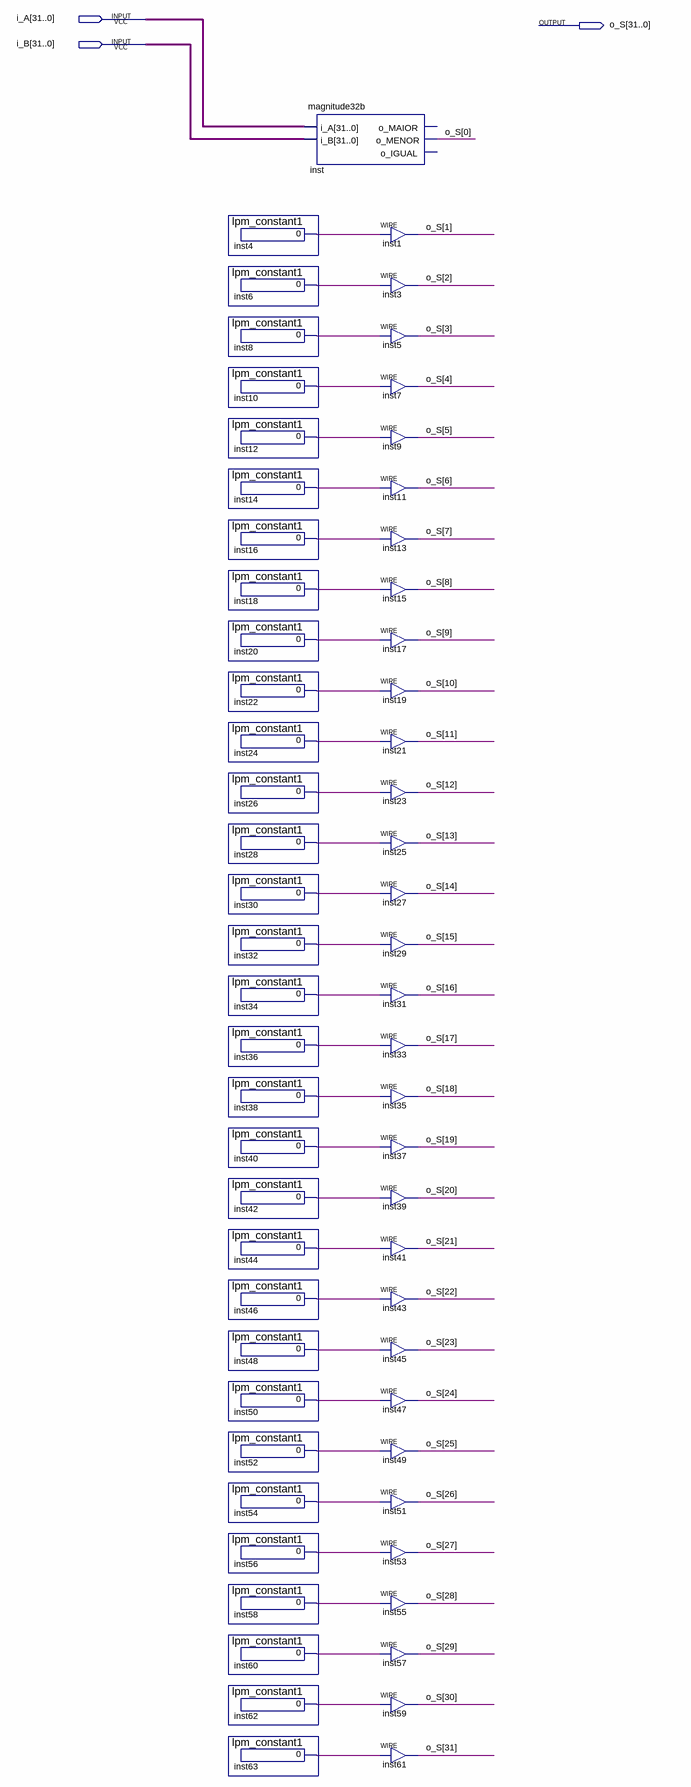
[diagram p0: schematic sheet]
// Quartus schematic set_on_less_than.bdf as structural Verilog: 63 symbols, 3 pins
module set_on_less_than (
  input  [31:0] i_A,
  input  [31:0] i_B,
  output [31:0] o_S
);

  wire inst4_result, inst6_result, inst8_result, inst10_result, inst12_result, inst14_result, inst16_result,
       inst18_result, inst20_result, inst22_result, inst24_result, inst26_result, inst28_result,
       inst30_result, inst32_result, inst34_result, inst36_result, inst38_result, inst40_result,
       inst42_result, inst44_result, inst46_result, inst48_result, inst50_result, inst52_result,
       inst54_result, inst56_result, inst58_result, inst60_result, inst62_result, inst63_result;

  lpm_constant1 inst4 (.result(inst4_result));
  lpm_constant1 inst6 (.result(inst6_result));
  lpm_constant1 inst8 (.result(inst8_result));
  lpm_constant1 inst10 (.result(inst10_result));
  lpm_constant1 inst12 (.result(inst12_result));
  lpm_constant1 inst14 (.result(inst14_result));
  lpm_constant1 inst16 (.result(inst16_result));
  lpm_constant1 inst18 (.result(inst18_result));
  lpm_constant1 inst20 (.result(inst20_result));
  lpm_constant1 inst22 (.result(inst22_result));
  lpm_constant1 inst24 (.result(inst24_result));
  lpm_constant1 inst26 (.result(inst26_result));
  lpm_constant1 inst28 (.result(inst28_result));
  lpm_constant1 inst30 (.result(inst30_result));
  lpm_constant1 inst32 (.result(inst32_result));
  lpm_constant1 inst34 (.result(inst34_result));
  lpm_constant1 inst36 (.result(inst36_result));
  lpm_constant1 inst38 (.result(inst38_result));
  lpm_constant1 inst40 (.result(inst40_result));
  lpm_constant1 inst42 (.result(inst42_result));
  lpm_constant1 inst44 (.result(inst44_result));
  lpm_constant1 inst46 (.result(inst46_result));
  lpm_constant1 inst48 (.result(inst48_result));
  lpm_constant1 inst50 (.result(inst50_result));
  lpm_constant1 inst52 (.result(inst52_result));
  lpm_constant1 inst54 (.result(inst54_result));
  lpm_constant1 inst56 (.result(inst56_result));
  lpm_constant1 inst58 (.result(inst58_result));
  lpm_constant1 inst60 (.result(inst60_result));
  lpm_constant1 inst62 (.result(inst62_result));
  lpm_constant1 inst63 (.result(inst63_result));
  magnitude32b inst (.i_A(i_A), .i_B(i_B), .o_MENOR(o_S[0]));  // open: o_MAIOR, o_IGUAL
  assign o_S[1] = inst4_result;  // WIRE inst1
  assign o_S[2] = inst6_result;  // WIRE inst3
  assign o_S[3] = inst8_result;  // WIRE inst5
  assign o_S[4] = inst10_result;  // WIRE inst7
  assign o_S[5] = inst12_result;  // WIRE inst9
  assign o_S[6] = inst14_result;  // WIRE inst11
  assign o_S[7] = inst16_result;  // WIRE inst13
  assign o_S[8] = inst18_result;  // WIRE inst15
  assign o_S[9] = inst20_result;  // WIRE inst17
  assign o_S[10] = inst22_result;  // WIRE inst19
  assign o_S[11] = inst24_result;  // WIRE inst21
  assign o_S[12] = inst26_result;  // WIRE inst23
  assign o_S[13] = inst28_result;  // WIRE inst25
  assign o_S[14] = inst30_result;  // WIRE inst27
  assign o_S[15] = inst32_result;  // WIRE inst29
  assign o_S[16] = inst34_result;  // WIRE inst31
  assign o_S[17] = inst36_result;  // WIRE inst33
  assign o_S[18] = inst38_result;  // WIRE inst35
  assign o_S[19] = inst40_result;  // WIRE inst37
  assign o_S[20] = inst42_result;  // WIRE inst39
  assign o_S[21] = inst44_result;  // WIRE inst41
  assign o_S[22] = inst46_result;  // WIRE inst43
  assign o_S[23] = inst48_result;  // WIRE inst45
  assign o_S[24] = inst50_result;  // WIRE inst47
  assign o_S[25] = inst52_result;  // WIRE inst49
  assign o_S[26] = inst54_result;  // WIRE inst51
  assign o_S[27] = inst56_result;  // WIRE inst53
  assign o_S[28] = inst58_result;  // WIRE inst55
  assign o_S[29] = inst60_result;  // WIRE inst57
  assign o_S[30] = inst62_result;  // WIRE inst59
  assign o_S[31] = inst63_result;  // WIRE inst61
endmodule
